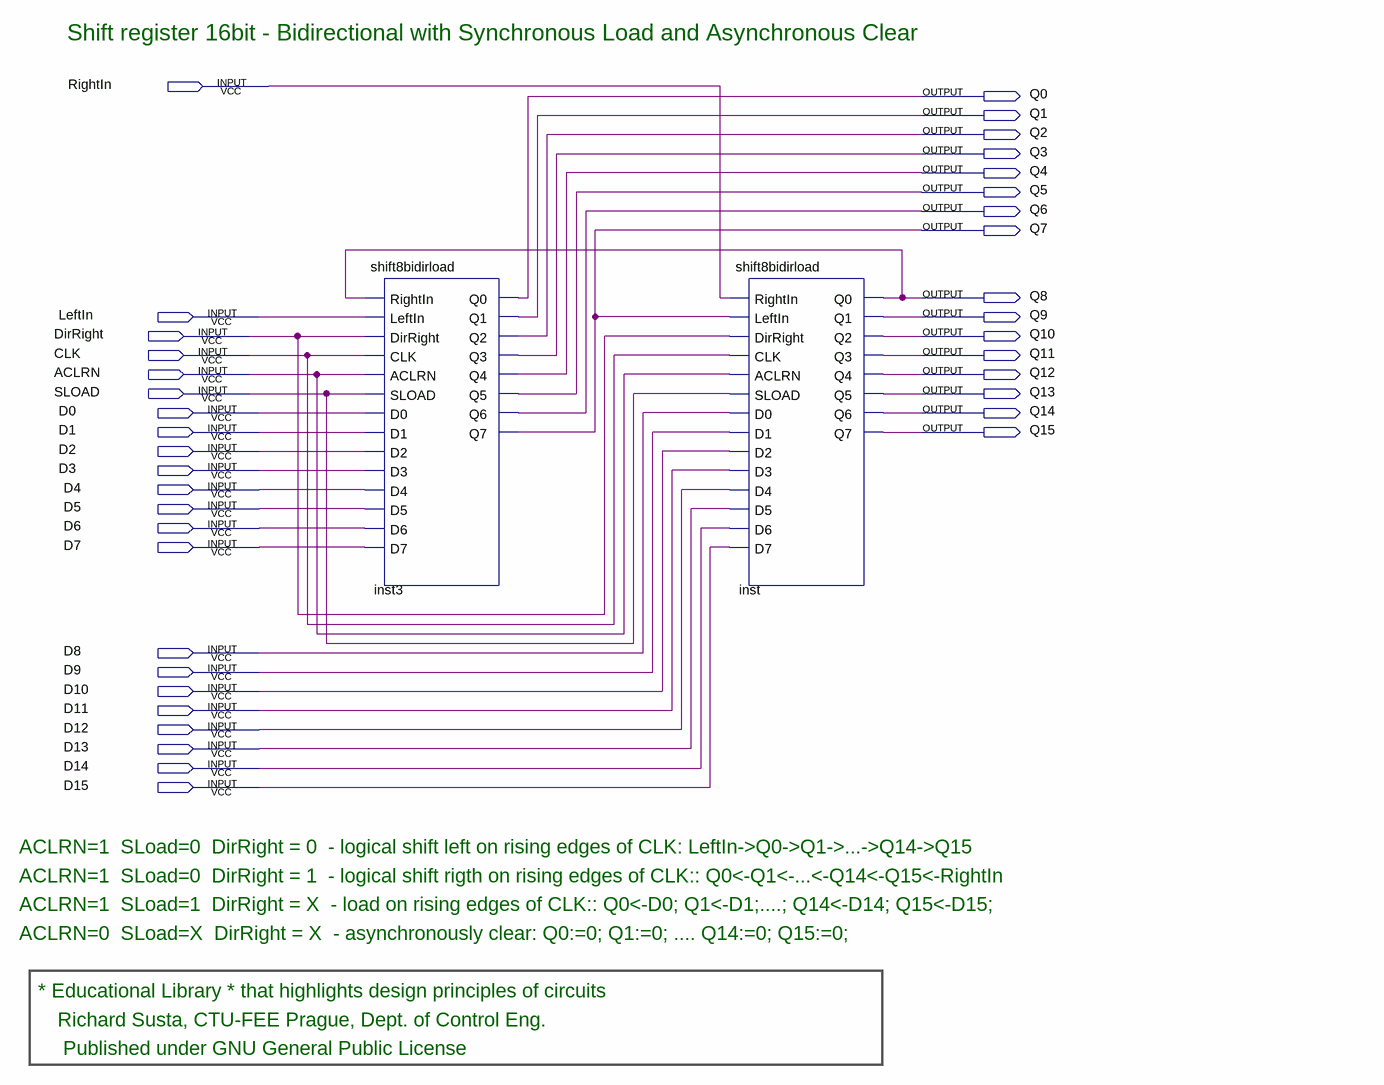
[diagram p0: schematic sheet]
// Quartus schematic shift16bidirload.bdf as structural Verilog: 2 symbols, 38 pins
module shift16bidirload (
  input  RightIn,
  input  LeftIn,
  input  DirRight,
  input  CLK,
  input  ACLRN,
  input  SLOAD,
  input  D0,
  input  D1,
  input  D2,
  input  D3,
  input  D4,
  input  D5,
  input  D6,
  input  D7,
  input  D8,
  input  D9,
  input  D10,
  input  D11,
  input  D12,
  input  D13,
  input  D14,
  input  D15,
  output Q0,
  output Q1,
  output Q2,
  output Q3,
  output Q4,
  output Q5,
  output Q6,
  output Q7,
  output Q8,
  output Q9,
  output Q10,
  output Q11,
  output Q12,
  output Q13,
  output Q14,
  output Q15
);

  shift8bidirload inst3 (
    .RightIn(Q8), .LeftIn(LeftIn), .DirRight(DirRight), .CLK(CLK), .ACLRN(ACLRN), .SLOAD(SLOAD), .D0(D0),
    .D1(D1), .D2(D2), .D3(D3), .D4(D4), .D5(D5), .D6(D6), .D7(D7), .Q0(Q0), .Q1(Q1), .Q2(Q2), .Q3(Q3),
    .Q4(Q4), .Q5(Q5), .Q6(Q6), .Q7(Q7));
  shift8bidirload inst (
    .RightIn(RightIn), .LeftIn(Q7), .DirRight(DirRight), .CLK(CLK), .ACLRN(ACLRN), .SLOAD(SLOAD), .D0(D8),
    .D1(D9), .D2(D10), .D3(D11), .D4(D12), .D5(D13), .D6(D14), .D7(D15), .Q0(Q8), .Q1(Q9), .Q2(Q10),
    .Q3(Q11), .Q4(Q12), .Q5(Q13), .Q6(Q14), .Q7(Q15));

  // Notes on the sheet:
  //   Shift register 16bit - Bidirectional with Synchronous Load and Asynchronous Clear
  //   ACLRN=1  SLoad=0  DirRight = 0  - logical shift left on rising edges of CLK: LeftIn->Q0->Q1->...->Q14->Q15
  //   ACLRN=1  SLoad=0  DirRight = 1  - logical shift rigth on rising edges of CLK:: Q0<-Q1<-...<-Q14<-Q15<-RightIn
  //   ACLRN=1  SLoad=1  DirRight = X  - load on rising edges of CLK:: Q0<-D0; Q1<-D1;....; Q14<-D14; Q15<-D15;
  //   ACLRN=0  SLoad=X  DirRight = X  - asynchronously clear: Q0:=0; Q1:=0; .... Q14:=0; Q15:=0;
  //   * Educational Library * that highlights design principles of circuits
  //   Richard Susta, CTU-FEE Prague, Dept. of Control Eng. 
  //    Published under GNU General Public License
endmodule
